# Altium schematic sheet Telemetry_Pi_Board.SchDoc
size 279 x 215 mm; SheetNumber: 1; SheetTotal: 6
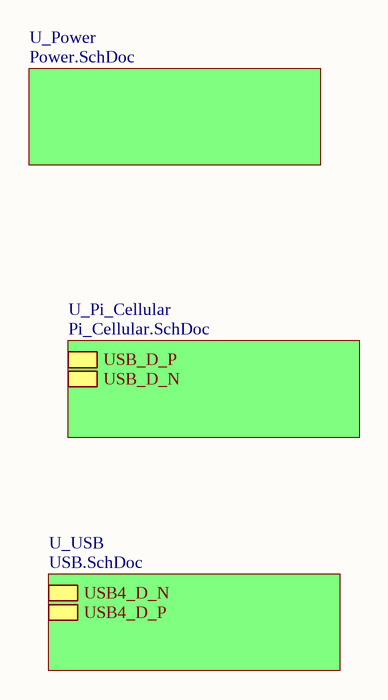
[diagram p0: Telemetry_Pi_Board.SchDoc]

## Sub-sheets
U_Pi_Cellular = Pi_Cellular.SchDoc: USB_D_P, USB_D_N
U_Power = Power.SchDoc: no entries
U_USB = USB.SchDoc: USB4_D_N, USB4_D_P